# EAGLE design freaq3 (EAGLE 7.7.0)
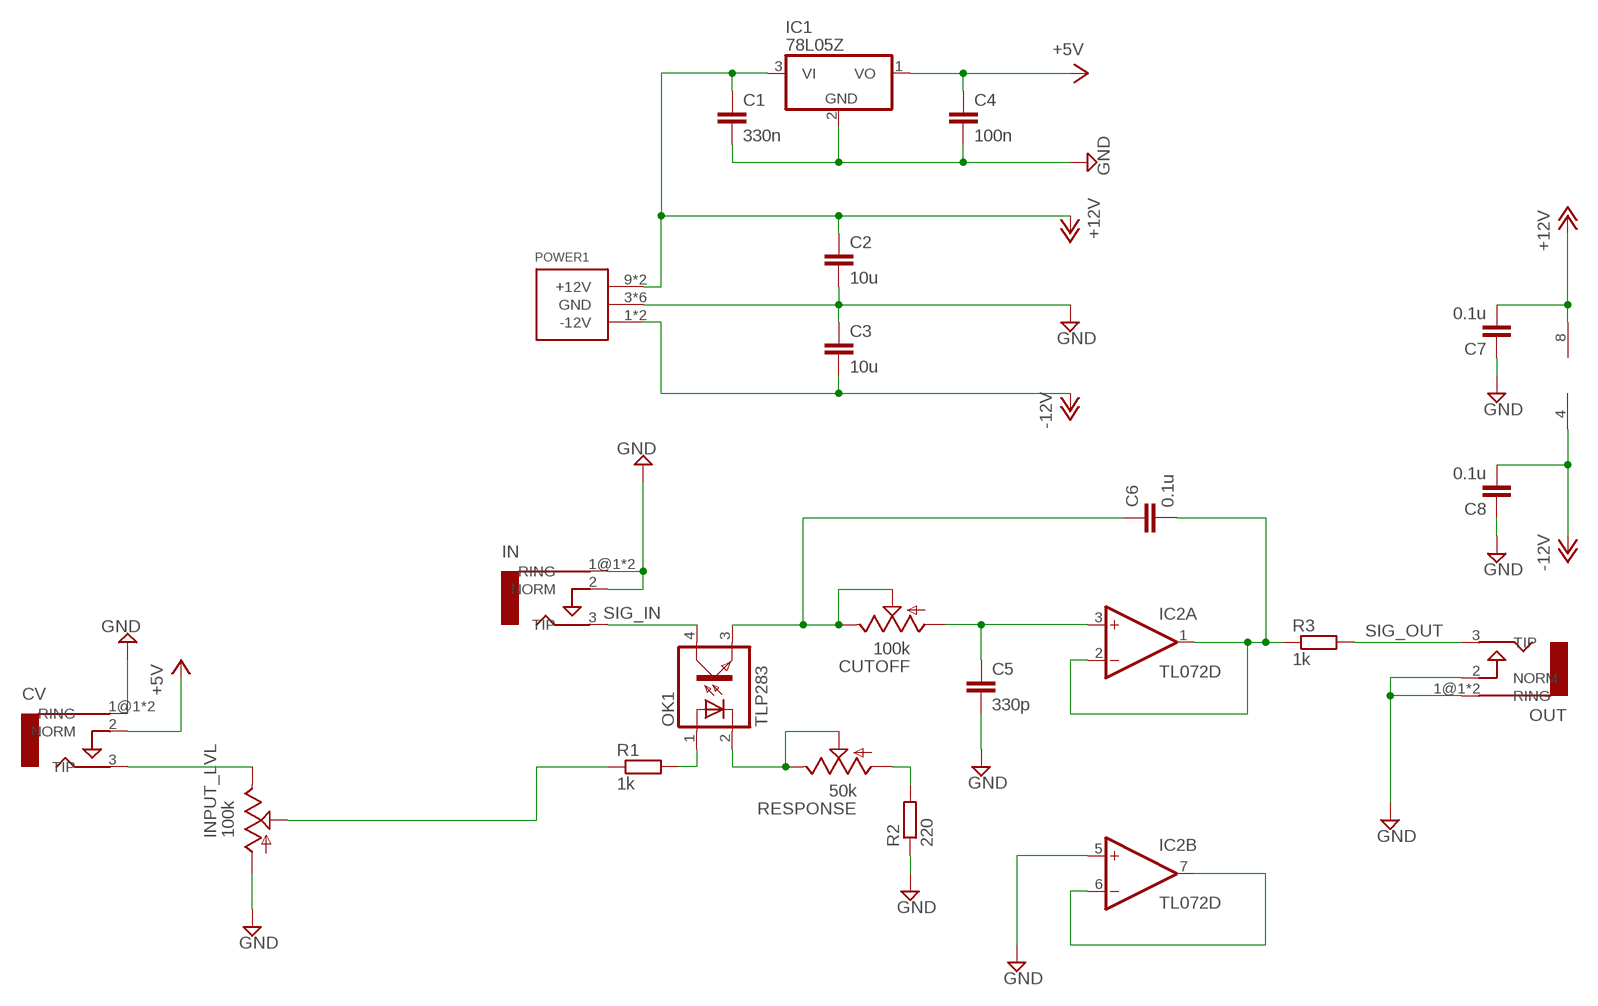
[diagram p0: schematic, sheet 1]

## Parts
C1  330n  C-EUC0805  [C0805]
C2  10u  C-EUC0805  [C0805]
C3  10u  C-EUC0805  [C0805]
C4  100n  C-EUC0805  [C0805]
C5  330p  C-EUC0805  [C0805]
C6  0.1u  C-EUC0805  [C0805]
C7  0.1u  C-EUC0805  [C0805]
C8  0.1u  C-EUC0805  [C0805]
CUTOFF  100k  9MM_SNAP-IN_POT_  [9MM_SNAP-IN_POT]
CV  AUDIO-JACKERTHENVAR  [ERTHENVAR-JACK]
IC1  78L05Z  [TO92]
IC2  TL072D  [SO08]
IN  AUDIO-JACKERTHENVAR  [ERTHENVAR-JACK]
INPUT_LVL  100k  9MM_SNAP-IN_POT_  [9MM_SNAP-IN_POT]
OK1  TLP283  [MINI-FLAT-4]
OUT  AUDIO-JACKERTHENVAR  [ERTHENVAR-JACK]
POWER1  POWER_SIMPLE10  [POWER_10]
R1  1k  R-EU_R0805  [R0805]
R2  220  R-EU_R0805  [R0805]
R3  1k  R-EU_R0805  [R0805]
RESPONSE  50k  9MM_SNAP-IN_POT_  [9MM_SNAP-IN_POT]

## Nets
+5V: C4.1 CV.2(NORM) IC1.1(VO)
+12V: C1.1 C2.1 C7.2 IC1.3(VI) IC2.8(P:V+) POWER1.9(+12V) POWER1.10(+12V)
-12V: C3.2 C8.2 IC2.4(P:V-) POWER1.1(-12V) POWER1.2(-12V)
GND: C1.2 C2.2 C3.1 C4.2 C5.2 C7.1 C8.1 CV.1@1(RING) CV.1@2(RING) IC1.2(GND) IC2.5(B:+IN) IN.1@1(RING) IN.1@2(RING) IN.2(NORM) INPUT_LVL.1(A) OUT.1@1(RING) OUT.1@2(RING) OUT.2(NORM) POWER1.3(GND) POWER1.4(GND) POWER1.5(GND) POWER1.6(GND) POWER1.7(GND) POWER1.8(GND) R2.1
N$1: C6.2 IC2.1(A:OUT) IC2.2(A:-IN) R3.1
N$2: C5.1 CUTOFF.1(A) IC2.3(A:+IN)
N$3: C6.1 CUTOFF.2(S) CUTOFF.3(E) OK1.3(EMIT)
N$4: INPUT_LVL.2(S) R1.1
N$5: IC2.6(B:-IN) IC2.7(B:OUT)
N$6: CV.3(TIP) INPUT_LVL.3(E)
N$7: OK1.2(C) RESPONSE.2(S) RESPONSE.3(E)
N$8: OK1.1(A) R1.2
N$12: R2.2 RESPONSE.1(A)
SIG_IN: IN.3(TIP) OK1.4(COL)
SIG_OUT: OUT.3(TIP) R3.2

## Library data of the parts
C1-C8 = rcl:C-EU: CAPACITOR, European symbol
CUTOFF INPUT_LVL RESPONSE = MusicThingModular:9MM_SNAP-IN_POT: 9mm vertical snap-in pot, Alpha / Panasonic style
CV IN OUT = erthenvar:AUDIO-JACK: Switching Mono 3.5mm Audio Jack from Erthenvar.
IC1 = linear:78*: Positive VOLTAGE REGULATOR Source: http://cache.national.com/ds/LM/LM78L05.pdf http://www.fairchildsemi.com/ds/LM/LM7805.pdf
IC2 = linear:TL072: OP AMP
OK1 = optocoupler:TLP283: TOSHIBA PHOTOCOUPLER GaAs IRED & PHOTO-TRANSISTOR Source: http://www.semicon.toshiba.co.jp/td/en/Opto/Photocoupler/en_20050928_TLP283_datasheet.pdf; OC_FARNELL: unknown; OC_NEWARK: unknown
POWER1 = eurorack:POWER_SIMPLE
R1-R3 = rcl:R-EU_: RESISTOR, European symbol

## Board
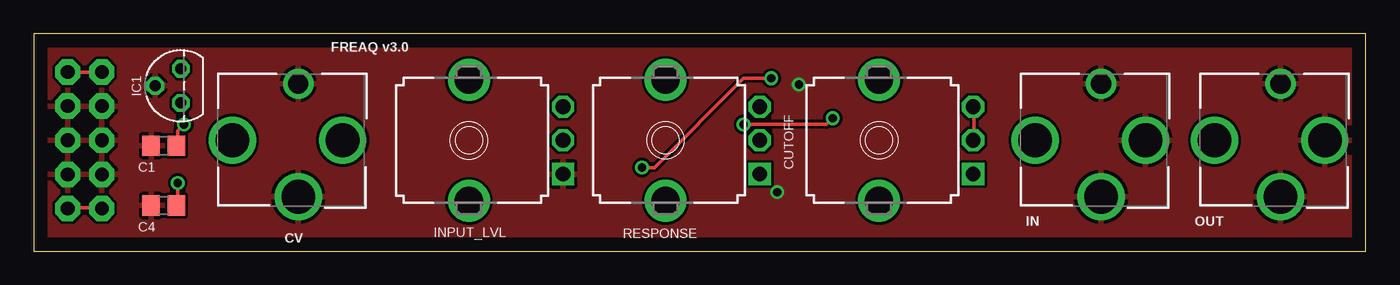
[diagram p1: board, top side]
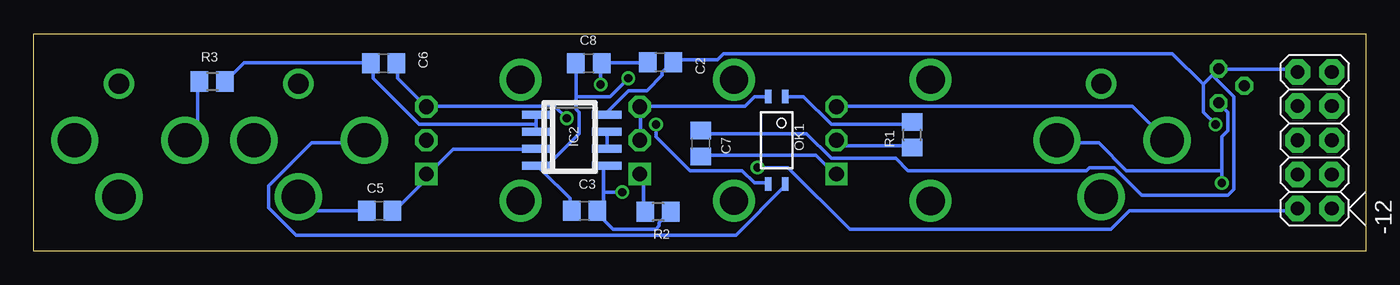
[diagram p2: board, bottom side, seen from below]

Size 99.05 x 16.18 mm. Coordinates in mm from the lower left corner, seen from the top.
Outline: 99.05,0 99.05,16.18 0,16.18 0,0 99.05,0
Copper layers (1*16): Top 0.035mm / dielectric 1.5mm / Bottom 0.035mm
Design rules "default": minimum track width 10mil, minimum drill 24mil, track to track 8mil, track to pad 8mil, pad to pad 8mil, via to via 8mil, smd to smd 8mil, copper to edge 40mil, drill to drill 8mil, minimum pad ring 10mil, minimum via ring 8mil, stop-mask expansion 4mil, vias tented up to drill 0mil, thermal gap 10mil

### Footprints (pad centres in the part's own frame; a part is rotated, then mirrored left to right if it is on the bottom)
C0805 = smd 1.3 x 1.5: 1 -0.95,0; 2 0.95,0
9MM_SNAP-IN_POT = drill 1.1 square: 1 -2.5,-7 | drill 1.1 octagon: 2 0,-7; 3 2.5,-7 | drill 2.1 pad 2.794: CHASSIS1 -4.5,0; CHASSIS2 4.5,0
ERTHENVAR-JACK = drill 2.5: 1@1 -4.2,0; 2 0,-3.3; 3 0,4.9 | drill 1.5: 1@2 4.2,0
TO92 = drill 0.813 octagon: 1 -1.27,0; 2 0,1.905; 3 1.27,0
SO08 = smd 0.6 x 2.2: 1 -1.905,-2.6; 2 -0.635,-2.6; 3 0.635,-2.6; 4 1.905,-2.6; 5 1.905,2.6; 6 0.635,2.6; 7 -0.635,2.6; 8 -1.905,2.6
MINI-FLAT-4 = smd 1 x 0.5: 1 -3.24,0.635; 2 -3.24,-0.635; 3 3.24,-0.635; 4 3.24,0.635
POWER_10 = drill 1.016 pad 1.88 octagon: 1 -5.08,-1.27; 2 -5.08,1.27; 3 -2.54,-1.27; 4 -2.54,1.27; 5 0,-1.27; 6 0,1.27; 7 2.54,-1.27; 8 2.54,1.27; 9 5.08,-1.27; 10 5.08,1.27
R0805 = smd 1.3 x 1.5: 1 -0.95,0; 2 0.95,0

### Placement (x,y rotation side)
C1  9.67,7.85 180 top
C2  52.45,14.05 180 bottom
C3  58.09,3.01 180 bottom
C4  9.67,3.41 180 top
C5  73.33,3.01 180 bottom
C6  73.02,13.97 180 bottom
C7  49.44,8.01 90 bottom
C8  57.77,13.97 180 bottom
CUTOFF  62.86,8.26 90 top
CV  19.67,8.26 90 top
IC1  10.94,12.3 90 top
IC2  59.05,8.26 270 bottom
IN  79.36,8.26 90 top
INPUT_LVL  32.36,8.25 90 top
OK1  43.8,8.26 270 bottom
OUT  92.7,8.26 90 top
POWER1  3.8,8.26 90 bottom
R1  33.73,8.66 90 bottom
R2  52.62,2.93 180 bottom
R3  85.76,12.62 180 bottom
RESPONSE  46.98,8.26 90 top

### Tracks (layer width: path | path; a pad name or v marks a point on that pad's centre or on a via)
+5V  (via drill 0.61)
  Top 0.254: v10.71,5.09 10.71,3.49 C4.1
  Bottom 0.254: 10.71,6 10.71,8.51 10.26,8.97 10.26,10.34 IC1.1 | 10.71,6 v10.71,5.09 | 10.71,6 17.8,6 19.86,8.06 22.83,8.06 CV.2
+12V  (via drill 0.61)
  Top 0.254: POWER1.9 2.71,13.32 5,13.32 POWER1.10 | v11.17,9.43 10.71,8.97 10.71,8.06 C1.1
  Bottom 0.254: IC2.8 56.43,10.34 54.83,11.94 53.46,11.94 52.32,13.09 52.32,13.32 51.63,14 C2.1 51.41,14.23 48.21,14.23 47.75,14.69 14.37,14.69 12.09,12.4 | v11.17,9.43 12.09,10.34 12.09,12.4 | 10.94,13.54 11.4,13.09 | 11.4,13.09 12.09,12.4 | 11.4,13.09 9.8,11.49 9.8,4.63 10.26,4.17 16.66,4.17 18.72,6.23 20.54,6.23 20.77,6 34.03,6 34.95,6.91 39.75,6.91 41.58,8.74 49.35,8.74 C7.2 | 10.94,13.54 5.23,13.54 POWER1.10 | 10.94,13.54 IC1.3
-12V  (via drill 0.61)
  Top 0.254: POWER1.1 2.71,3.26 5,3.26 POWER1.2 | v45.23,6.23 46.15,6.23 52.78,12.86 v54.83,12.86
  Bottom 0.254: 61.24,6 61.46,6.23 IC2.4 | 61.24,6 59.18,3.94 59.18,3.03 C3.2 | 58.72,11.49 58.72,10.57 58.49,10.34 58.49,8.74 61.24,6 | 58.72,11.49 58.72,13.77 C8.2 | v45.23,6.23 42.95,6.23 38.38,1.66 18.94,1.66 17.57,3.03 5.23,3.03 POWER1.2 | v54.83,12.86 56.21,11.49 58.72,11.49
GND  (via drill 0.61)
  Bottom 0.254: R2.1 51.86,2.8 52.55,2.11 52.55,1.89 52.78,1.66 55.98,1.66 57.12,2.8 C3.1 57.12,3.03 56.66,3.49 56.66,4.4 | 56.66,4.4 56.66,6.23 IC2.5 | C2.2 53.46,14 56.66,14 C8.1 56.89,13.77 v56.89,12.4 | C5.2 74.49,3.03 78.38,3.03 79.29,3.94 IN.1@1 | C7.1 49.35,7.14 40.89,7.14 39.52,5.77 INPUT_LVL.1 | v55.29,4.4 56.66,4.4
  pour Top: -0.01,0 -0.01,16.51 99.05,16.51 99.05,0
N$1
  Bottom 0.254: 61.69,9.43 61.69,10.12 IC2.1 | 61.69,9.43 61.69,8.97 IC2.2 | R3.1 84.78,12.63 83.41,14 74.04,14 C6.2 73.81,13.77 73.81,12.86 70.38,9.43 61.69,9.43
N$2
  Bottom 0.254: C5.1 72.21,3.03 69.69,5.54 CUTOFF.1 69.69,5.77 67.86,7.6 61.69,7.6 IC2.3
N$3  (via drill 0.61)
  Top 0.254: v52.78,9.43 58.95,9.43 v59.41,9.89 | CUTOFF.2 69.92,8.29 69.92,10.57 CUTOFF.3
  Bottom 0.254: v52.78,9.43 52.78,8.51 50.26,6 46.38,6 45.46,5.09 44.55,5.09 OK1.3 | v59.41,9.89 60.32,10.8 69.69,10.8 CUTOFF.3 69.92,10.8 71.98,12.86 71.98,13.77 C6.1
N$4
  Bottom 0.254: R1.1 33.8,7.83 39.06,7.83 39.29,8.06 INPUT_LVL.2
N$5
  Bottom 0.254: IC2.6 56.43,7.83 56.43,8.74 IC2.7
N$6
  Bottom 0.254: INPUT_LVL.3 39.29,10.8 17.34,10.8 14.83,8.29 CV.3
N$7
  Bottom 0.254: OK1.2 44.55,11.49 45.46,11.49 46.15,10.8 53.92,10.8 RESPONSE.3 53.92,10.57 53.92,8.29 RESPONSE.2
N$8
  Bottom 0.254: OK1.1 42.95,11.49 41.8,11.49 39.75,9.43 33.8,9.43 R1.2
N$12
  Bottom 0.254: R2.2 53.69,3.03 53.69,5.31 53.92,5.54 RESPONSE.1
SIG_IN
  Bottom 0.254: OK1.4 43.18,4.86 46.83,1.2 79.52,1.2 81.58,3.26 81.58,4.86 78.38,8.06 74.49,8.06 IN.3
SIG_OUT
  Bottom 0.254: R3.2 86.84,12.4 86.84,9.2 87.75,8.29 OUT.3

### Text on the board
tNames: FREAQ v3.0